# Altium schematic sheet SpectrumAnalyzer.SchDoc
size A4; SheetNumber: 3; SheetTotal: 5
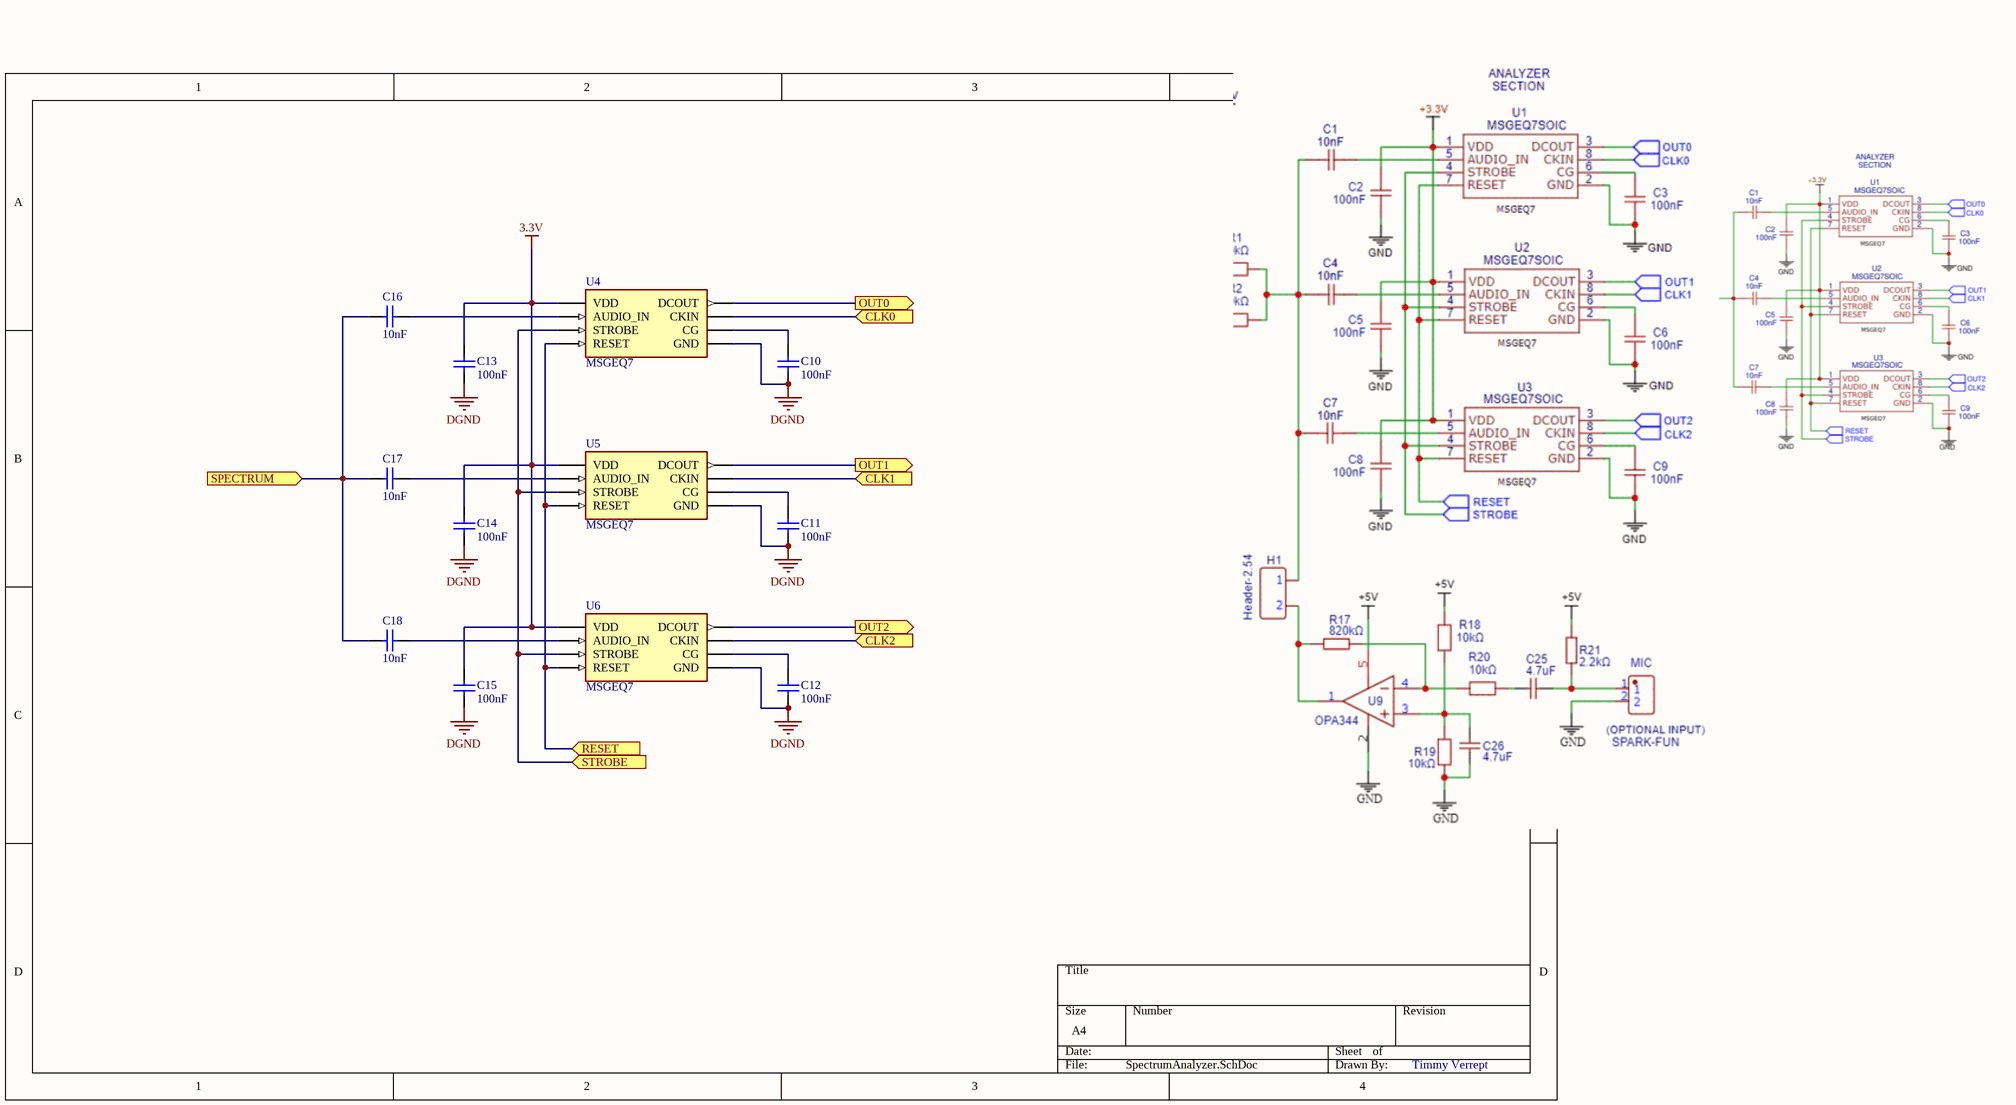
[diagram p0: SpectrumAnalyzer.SchDoc]

## Parts
C10  100nF  [SMD_CAPACITOR]
C11  100nF  [SMD_CAPACITOR]
C12  100nF  [SMD_CAPACITOR]
C13  100nF  [SMD_CAPACITOR]
C14  100nF  [SMD_CAPACITOR]
C15  100nF  [SMD_CAPACITOR]
C16  10nF  [SMD_CAPACITOR]
C17  10nF  [SMD_CAPACITOR]
C18  10nF  [SMD_CAPACITOR]
U4  MSGEQ7  [MSGEQ7]
U5  MSGEQ7  [MSGEQ7]
U6  MSGEQ7  [MSGEQ7]

## Ports
CLK0 (in, see ClockGenerator[3B]), CLK1 (in, see ClockGenerator[3B]), CLK2 (in, see ClockGenerator[3B]), OUT0 (out, see ESP32-Controls[2B]), OUT1 (out, see ESP32-Controls[2B]), OUT2 (out, see ESP32-Controls[2B]), RESET (in, see ESP32-Controls[1B]), SPECTRUM (in, see AudioFrontend[4B]), STROBE (in, see ESP32-Controls[1B])

## Nets
3.3V: C13.2 C14.2 C15.2 U4.1(VDD) U5.1(VDD) U6.1(VDD)
DGND: C10.1 C11.1 C12.1 C13.1 C14.1 C15.1 U4.2(GND) U5.2(GND) U6.2(GND)
CLK0: U4.8(CKIN) ; port CLK0
CLK1: U5.8(CKIN) ; port CLK1
CLK2: U6.8(CKIN) ; port CLK2
OUT0: U4.3(DCOUT) ; port OUT0
OUT1: U5.3(DCOUT) ; port OUT1
OUT2: U6.3(DCOUT) ; port OUT2
RESET: U4.7(RESET) U5.7(RESET) U6.7(RESET) ; port RESET
SPECTRUM: C16.2 C17.2 C18.2 ; port SPECTRUM
STROBE: U4.4(STROBE) U5.4(STROBE) U6.4(STROBE) ; port STROBE
NetC10_2: C10.2 U4.6(CG)
NetC11_2: C11.2 U5.6(CG)
NetC12_2: C12.2 U6.6(CG)
NetC16_1: C16.1 U4.5(AUDIO_IN)
NetC17_1: C17.1 U5.5(AUDIO_IN)
NetC18_1: C18.1 U6.5(AUDIO_IN)

## Notes on the sheet
- Timmy Verrept

## Library data of the parts
C10-C18 = CER Capacitor: Manufacturer: Vitramon; Part Number: VJ0805Y682KXAMT
U4-U6 = MSGEQ7: MSGEQ7 Signal Level Control Interface Arduino Platform Evaluation Expansion Board; MF: SparkFun Electronics; Price: None; Availability: Unavailable; SnapEDA_Link: https://www.snapeda.com/parts/MSGEQ7/SparkFun%20Electronics/view-part/106617/?ref=snap; Value: *; Package: SOIC-8 Mixed Signal Integration; MP: MSGEQ7